# EAGLE design YOTSUBA_GNSS-receiver_Orion_ver.1.3 (EAGLE 9.6.2)
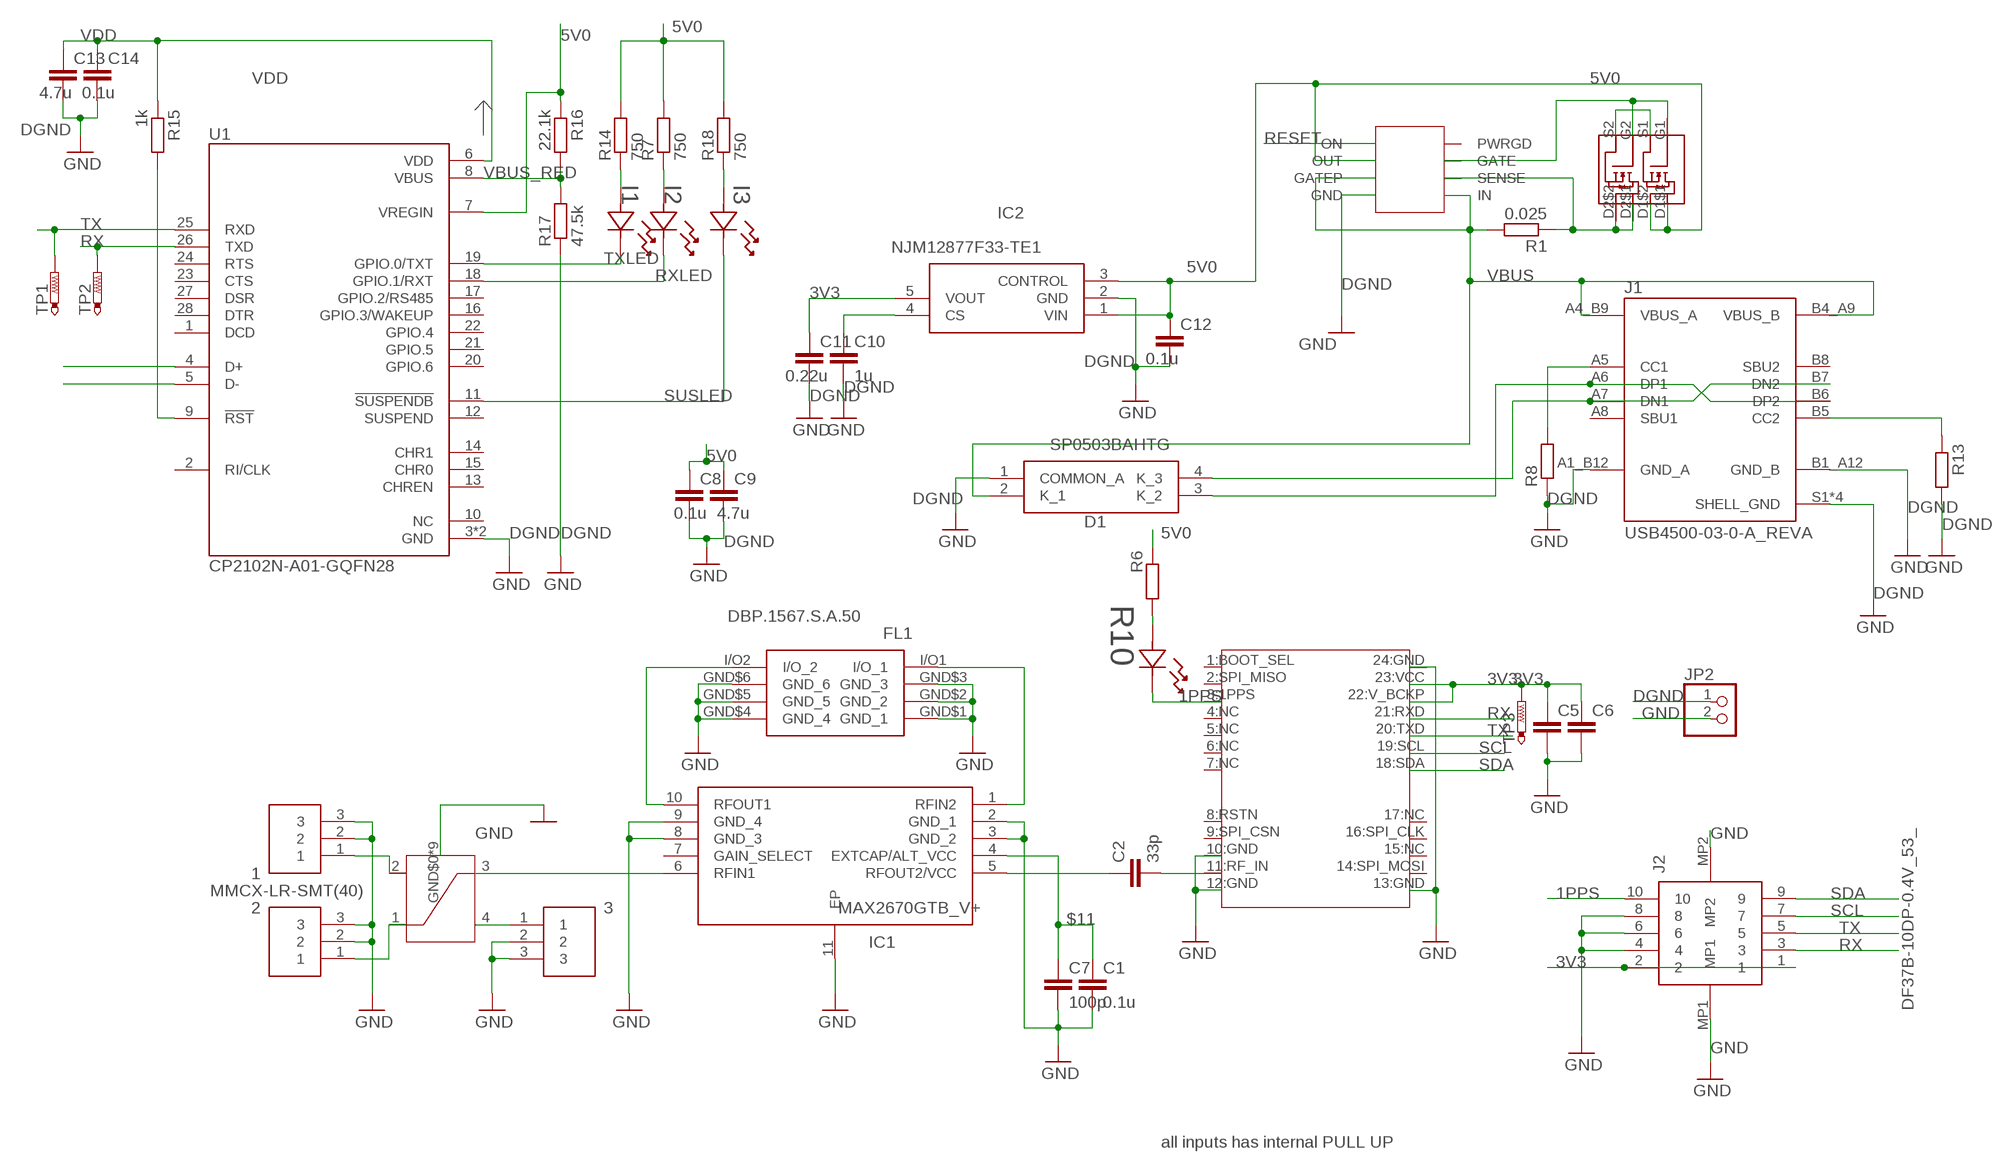
[diagram p0: schematic, sheet 1]

## Parts
1  MMCX-LR-SMT(40)  [MMCX-LR-SMT(40)]
2  MMCX-LR-SMT(40)  [MMCX-LR-SMT(40)]
3  MMCX-LR-SMT(40)  [MMCX-LR-SMT(40)]
C1  0.1u  C-EUC1608  [C1608]
C2  33p  C-EUC1608  [C1608]
C5  C-EUC1608  [C1608]
C6  C-EUC1608  [C1608]
C7  100p  C-EUC1608  [C1608]
C8  0.1u  C-EUC1608  [C1608]
C9  4.7u  C-EUC1608  [C1608]
C10  1u  C-EUC1608  [C1608]
C11  0.22u  C-EUC1608  [C1608]
C12  0.1u  C-EUC1608  [C1608]
C13  4.7u  C-EUC1608  [C1608]
C14  0.1u  C-EUC1608  [C1608]
D1  SP0503BAHTG  [SP0503BAHTG]
FL1  DBP.1567.S.A.50  [DBP1567SA50]
I1  SML-E12P8WT86  [LED_SMLD12_ROM]
I2  SML-E12P8WT86  [LED_SMLD12_ROM]
I3  SML-E12P8WT86  [LED_SMLD12_ROM]
IC1  MAX2670GTB_V+  [SON50P300X300X80-11N]
IC2  NJM12877F33-TE1  [SOT95P280X120-5N]
J1  USB4500-03-0-A_REVA  [GCT_USB4500-03-0-A_REVA]
J2  DF37B-10DP-0.4V_53_  [DF37B10DP04V53]
JP2  PINHD-1X2/90  [1X02/90]
R1  0.025  R-EU_R0603  [R0603]
R6  R-EU_R0603  [R0603]
R7  750  R-EU_R0603  [R0603]
R8  R-EU_R0603  [R0603]
R10  SML-E12P8WT86  [LED_SMLD12_ROM]
R13  R-EU_R0603  [R0603]
R14  750  R-EU_R0603  [R0603]
R15  1k  R-EU_R0603  [R0603]
R16  22.1k  R-EU_R0603  [R0603]
R17  47.5k  R-EU_R0603  [R0603]
R18  750  R-EU_R0603  [R0603]
TP1  PTR1B1,27  [B1,27]
TP2  PTR1B1,27  [B1,27]
TP3  PTR1B1,27  [B1,27]
U1  CP2102N-A01-GQFN28  [QFN50P500X500X80-29N]
U$1  ORION_B16  [ORION_B16]
U$3  HC125.A  [HC125.A]
U$7  DMG6898LSD  [SOIC127P600X150-8N]
U$8  LTC4361  [SOP65P280X100-8N]

## Nets
1PPS: J2.10 R10.1 U$1.3:1PPS
3V3 [POWER]: C5.1 C6.1 C11.1 IC2.5(VOUT) J2.1 J2.2 TP3.TP U$1.22:V_BCKP U$1.23:VCC
5V0 [POWER]: C8.1 C9.1 C12.1 IC2.1(VIN) IC2.3(CONTROL) R6.2 R7.2 R14.2 R16.1 R18.2 U1.7(VREGIN) U$7.D1$1 U$7.D1$2 U$8.OUT
$11 [POWER]: C1.1 C7.1 IC1.4(EXTCAP/ALT_VCC)
D+: D1.3(K_2) J1.A6(DP1) J1.B6(DP2) U1.4(D+)
D-: D1.4(K_3) J1.A7(DN1) J1.B7(DN2) U1.5(D-)
DGND [gnd]: C8.2 C9.2 C10.2 C11.2 C12.2 C13.2 C14.2 D1.1(COMMON_A) IC2.2(GND) J1.A1_B12(GND_A) J1.B1_A12(GND_B) J1.S1(SHELL_GND) J1.S2(SHELL_GND) J1.S3(SHELL_GND) J1.S4(SHELL_GND) JP2.1 R8.1 R13.2 R17.1 U1.3(GND) U1.29(GND) U$8.GND ; supply symbol labelled GND
GND [gnd]: 1.2 1.3 2.2 2.3 3.2 3.3 C1.2 C5.2 C6.2 C7.2 FL1.GND$1(GND_1) FL1.GND$2(GND_2) FL1.GND$3(GND_3) FL1.GND$4(GND_4) FL1.GND$5(GND_5) FL1.GND$6(GND_6) IC1.2(GND_1) IC1.3(GND_2) IC1.8(GND_3) IC1.9(GND_4) IC1.11(EP) J2.4 J2.6 J2.8 J2.MP1 J2.MP2 JP2.2 U$1.10:GND U$1.12:GND U$1.13:GND U$1.24:GND U$3.GND$0(GND) U$3.GND$1(GND) U$3.GND$2(GND) U$3.GND$3(GND) U$3.GND$4(GND) U$3.GND$5(GND) U$3.GND$6(GND) U$3.GND$7(GND) U$3.GND$8(GND)
N$1 [1.1mm]: 1.1 U$3.2
N$2 [1.1mm]: 2.1 U$3.1
N$3 [50Ω]: IC1.6(RFIN1) U$3.3
N$4: C10.1 IC2.4(CS)
N$5: I2.2 R7.1
N$6 [1.1mm]: 3.1 U$3.4
N$8 [50Ω]: FL1.I/O2(I/O_2) IC1.10(RFOUT1)
N$9 [50Ω]: FL1.I/O1(I/O_1) IC1.1(RFIN2)
N$11 [50Ω]: C2.1 IC1.5(RFOUT2/VCC)
N$12 [50Ω]: C2.2 U$1.11:RF_IN
N$13: I1.2 R14.1
N$15: R6.1 R10.2
N$16: I3.2 R18.1
N$19: U$7.S1 U$7.S2
N$20: R1.1 U$7.D2$1 U$7.D2$2 U$8.SENSE
N$21: J1.B5(CC2) R13.1
N$22: U$7.G1 U$7.G2 U$8.GATE
N$23: J1.A5(CC1) R8.2
N$27: R15.2 U1.9(!RST)
RESET [gnd]: U$8.ON
RX: J2.3 TP2.TP U1.26(TXD) U$1.21:RXD
RXLED: I2.1 U1.18(GPIO.1/RXT)
SCL: J2.7 U$1.19:SCL
SDA: J2.9 U$1.18:SDA
SUSLED: I3.1 U1.11(!SUSPENDB)
TX: J2.5 TP1.TP U1.25(RXD) U$1.20:TXD
TXLED: I1.1 U1.19(GPIO.0/TXT)
VBUS: D1.2(K_1) J1.A4_B9(VBUS_A) J1.B4_A9(VBUS_B) R1.2 U$8.GATEP U$8.IN
VBUS_RED: R16.2 R17.2 U1.8(VBUS)
VDD: C13.1 C14.1 R15.1 U1.6(VDD)
Unconnected: IC1.7(GAIN_SELECT) J1.A8(SBU1) J1.B8(SBU2) U1.1(DCD) U1.2(RI/CLK) U1.10(NC) U1.12(SUSPEND) U1.13(CHREN) U1.14(CHR1) U1.15(CHR0) U1.16(GPIO.3/WAKEUP) U1.17(GPIO.2/RS485) U1.20(GPIO.6) U1.21(GPIO.5) U1.22(GPIO.4) U1.23(CTS) U1.24(RTS) U1.27(DSR) U1.28(DTR) U$1.1:BOOT_SEL U$1.2:SPI_MISO U$1.4:NC U$1.5:NC U$1.6:NC U$1.7:NC U$1.8:RSTN U$1.9:SPI_CSN U$1.14:SPI_MOSI U$1.15:NC U$1.16:SPI_CLK U$1.17:NC U$8.PWRGD

## Notes on the sheet
- all inputs has internal PULL UP

## Library data of the parts
1-3 = MMCX-LR-SMT(40):MMCX-LR-SMT(40)
C1 C2 C5-C14 = rcl:C-EU: CAPACITOR, European symbol; SPICEPREFIX: C
D1 = SamacSys_Parts:SP0503BAHTG: ESD Suppressors / TVS Diodes TVS AVAL DIODE SMT Source: Datasheet <https://nl.mouser.com/datasheet/2/240/Littelfuse_TVS_Diode_Array_SP05_Datasheet.pdf-777043.pdf>; ARROW_PART_NUMBER: SP0503BAHTG; ARROW_PRICE-STOCK: https://www.arrow.com/en/products/sp0503bahtg/littelfuse?region=europe; DESCRIPTION: ESD Suppressors / TVS Diodes TVS AVAL DIODE SMT; HEIGHT: 1.22mm; MANUFACTURER_NAME: LITTELFUSE; MANUFACTURER_PART_NUMBER: SP0503BAHTG; MOUSER_PART_NUMBER: 576-SP0503BAHTG; MOUSER_PRICE-STOCK: https://www.mouser.co.uk/ProductDetail/Littelfuse/SP0503BAHTG?qs=uD%2FdkN7XIa0NTYXwHdELYA%3D%3D
FL1 = DBP.1567.S.A.50:DBP.1567.S.A.50: Ceramic Filters Band Pass 1567.5MHz 1dB 50Ohm SMD 2Pin Source: Datasheet <https://www.taoglas.com/datasheets/DBP.1567.S.A.50.pdf>; DESCRIPTION: Ceramic Filters Band Pass 1567.5MHz 1dB 50Ohm SMD 2Pin; HEIGHT: 4.2mm; MANUFACTURER_NAME: Taoglas; MANUFACTURER_PART_NUMBER: DBP.1567.S.A.50
I1-I3 R10 = LED_1608_2:SML-E12P8WT86; COPYRIGHT: Copyright (C) 2023 Ultra Librarian. All rights reserved.; DIGI-KEY_PART_NUMBER_1: 511-1585-1-ND; DIGI-KEY_PART_NUMBER_2: 511-1585-2-ND; DIGI-KEY_PART_NUMBER_3: 511-1585-6-ND; MANUFACTURER_PART_NUMBER: SML-E12P8WT86; MFR_NAME: ROHM Semiconductor
IC1 = MAX2670GTB_V+:MAX2670GTB_V+: RF Amplifier GPS/GNSS Front End Amplifier Source: Datasheet <https://componentsearchengine.com/Datasheets/1/MAX2670GTB_V .pdf>; DESCRIPTION: RF Amplifier GPS/GNSS Front End Amplifier; HEIGHT: 0.8mm; MANUFACTURER_NAME: Analog Devices; MANUFACTURER_PART_NUMBER: MAX2670GTB/V+; MOUSER_PART_NUMBER: 700-MAX2670GTB/V+; MOUSER_PRICE-STOCK: https://www.mouser.com/Search/Refine.aspx?Keyword=700-MAX2670GTB%2FV%2B
IC2 = SamacSys_Parts:NJM12877F33-TE1: LDO Voltage Regulators LDO ADJ High Ripple 3.3V Vo 1% 200mA Source: Datasheet <https://datasheet.datasheetarchive.com/originals/distributors/Datasheets_SAMA/e828f6bebe4b9138c37698b69374413c.pdf>; DESCRIPTION: LDO Voltage Regulators LDO ADJ High Ripple 3.3V Vo 1% 200mA; HEIGHT: 1.2mm; MANUFACTURER_NAME: New Japan Radio; MANUFACTURER_PART_NUMBER: NJM12877F33-TE1; MOUSER_PART_NUMBER: 513-NJM12877F33-TE1; MOUSER_PRICE-STOCK: https://www.mouser.com/Search/Refine.aspx?Keyword=513-NJM12877F33-TE1
J1 = USB4500-03-0-A_REVA:USB4500-03-0-A_REVA; DESCRIPTION: USB-C (USB TYPE-C) USB 2.0 Receptacle Connector 24 (16+8 Dummy) Position Board Edge, Cutout; Surface Mount; Through Hole, Right Angle; DIGI-KEY_PART_NUMBER: 2073-USB4500-03-0-ATR-ND; MF: Global Connector Technology; MP: USB4500-03-0-A; PACKAGE: None; PURCHASE-URL: https://pricing.snapeda.com/search/part/USB4500-03-0-A/?ref=eda
J2 = DF37B-10DP-0.4V_53_:DF37B-10DP-0.4V_53_: Board to Board & Mezzanine Connectors 0.4MM 10P HEADER VERT SMT M-FITTING Source: Datasheet <https://www.arrow.com/en/products/df37b-10dp-0.4v-53/hirose-electric>; DESCRIPTION: Board to Board & Mezzanine Connectors 0.4MM 10P HEADER VERT SMT M-FITTING; HEIGHT: 0.76mm; MANUFACTURER_NAME: Hirose; MANUFACTURER_PART_NUMBER: DF37B-10DP-0.4V(53); MOUSER_PART_NUMBER: 798-DF37B10DP04V53; MOUSER_PRICE-STOCK: https://www.mouser.co.uk/ProductDetail/Hirose-Connector/DF37B-10DP-0.4V53?qs=eDUdFcBPps0qYYvduP3T2g%3D%3D
JP2 = pinhead:PINHD-1X2: PIN HEADER
R1 R6-R8 R13-R18 = rcl:R-EU_: RESISTOR, European symbol; SPICEPREFIX: R
TP1-TP3 = testpad:PTR1: TEST PIN
U1 = CP2102N-A01-GQFN28:CP2102N-A01-GQFN28: USB Bridge, USB to UART USB 2.0 UART Interface 28-QFN (5x5) Check availability <https://pricing.snapeda.com/parts/CP2102N-A01-GQFN28/Silicon%20Labs/view-part?ref=eda>; AVAILABILITY: In Stock; DESCRIPTION: USB Bridge, USB to UART USB 2.0 UART Interface 28-QFN (5x5); MF: Silicon Labs; MP: CP2102N-A01-GQFN28; PACKAGE: QFN-28 Silicon Labs; PRICE: None; PURCHASE-URL: https://pricing.snapeda.com/search/part/CP2102N-A01-GQFN28/?ref=eda
U$1 = Orion_B16:ORION_B16
U$3 = HC125.A:HC125.A
U$7 = DMG6898LSD:DMG6898LSD
U$8 = ltc4361:LTC4361

## Net classes
0 default: clearance 0.121 mm
2 gnd: clearance 0.21 mm to class 1, clearance 0.254 mm
3 POWER: width 0.178 mm, clearance 0.025 mm
4 1.1mm: clearance 0.247 mm to class 1

## Board
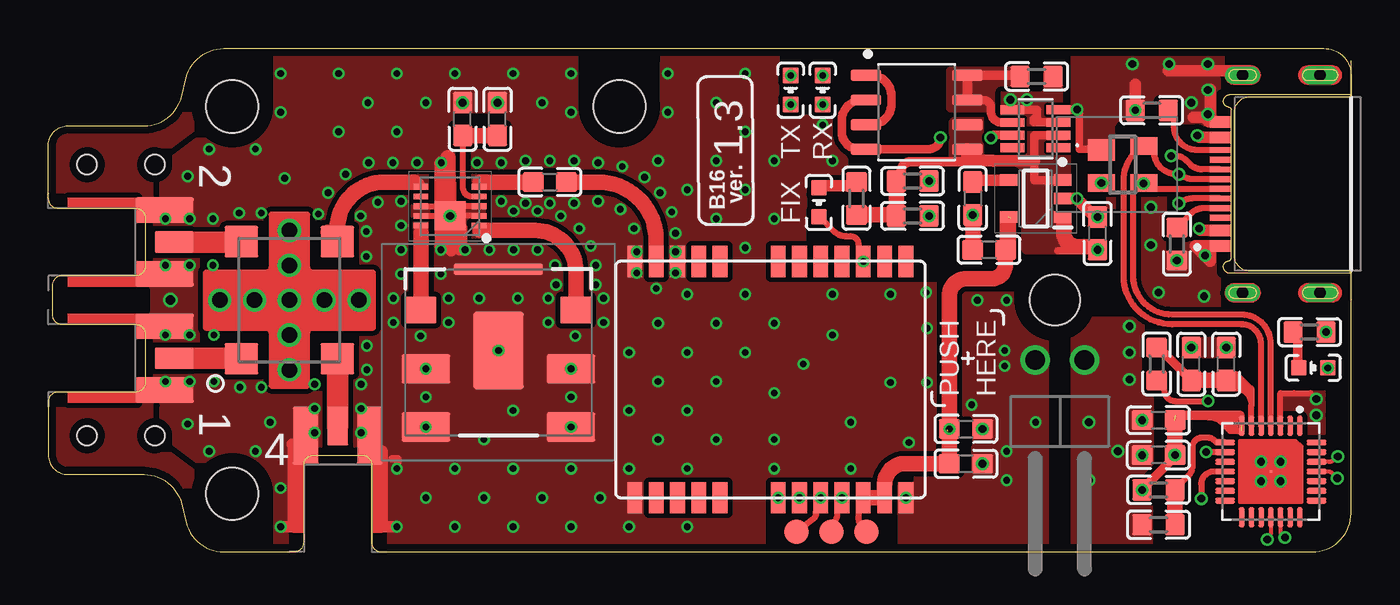
[diagram p1: board, top side]
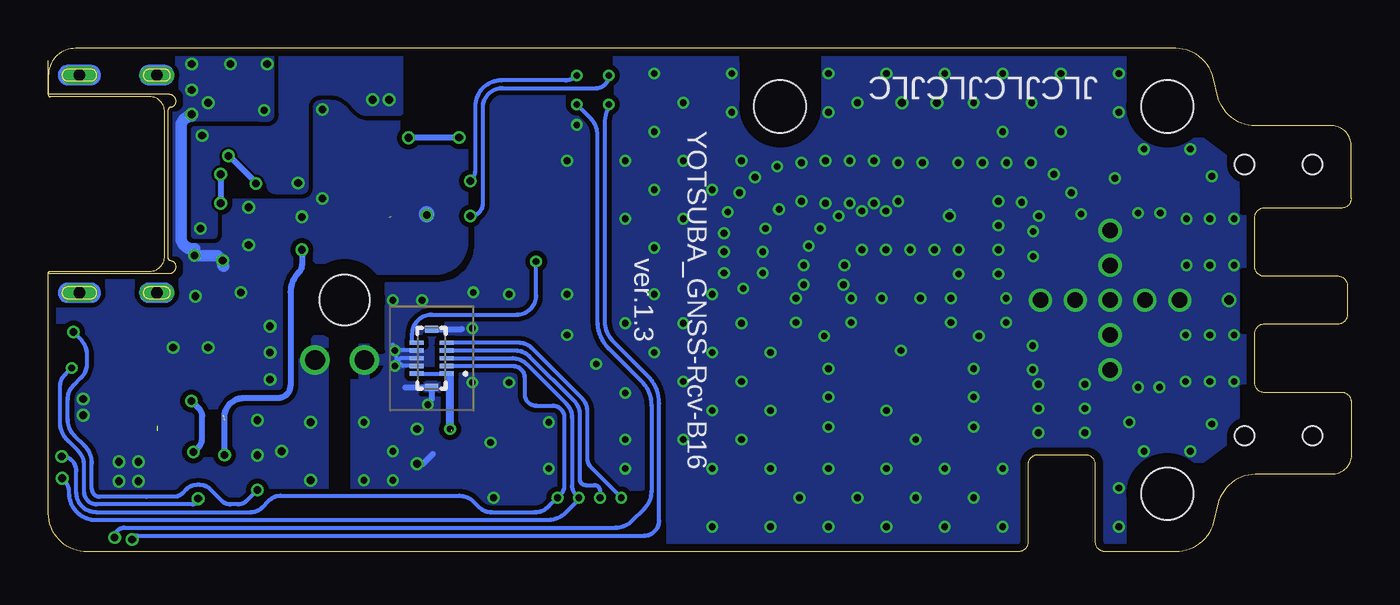
[diagram p2: board, bottom side, seen from below]

Size 67.3 x 26 mm. Coordinates in mm from the lower left corner, seen from the top.
Outline: 1,4 4.94,4 arc-76 6.88,2.48 7.12,1.51 arc76 9.06,0 12.7,0 arc90 13.2,0.5 13.2,4.5 arc-90 13.7,5 16.2,5 arc-90 16.7,4.5 16.7,0.5 arc90 17.2,0 65.3,0 arc90 67.3,2 67.3,14.4 arc90 67.2,14.5 62.05,14.5 arc-90 61.3,15.25 61.3,22.75 arc-90 62.05,23.5 67.2,23.5 arc90 67.3,23.6 67.3,24.6 arc90 65.9,26 9.06,26 arc76 7.12,24.48 6.88,23.52 arc-76 4.94,22 1,22 arc90 0,21 0,18.25 arc90 0.5,17.75 4.5,17.75 arc-90 5,17.25 5,14.75 arc-90 4.5,14.25 0.7,14.25 arc90 0.2,13.75 0.2,12.25 arc90 0.7,11.75 4.5,11.75 arc-90 5,11.25 5,8.75 arc-90 4.5,8.25 0.5,8.25 arc90 0,7.75 0,5 arc90 1,4
Copper layers (1*16): Top 0.035mm / dielectric 1.2mm / Bottom 0.035mm
Design rules "default *": minimum track width 6mil, minimum drill 0.35mm, track to track 5mil, track to pad 0.2mm, pad to pad 5mil, via to via 0.5mm, smd to smd 5mil, copper to edge 0.4mm, drill to drill 6mil, minimum pad ring 0.13mm, minimum via ring 0.13mm, stop-mask expansion 0.038mm, vias tented up to drill 30mil, thermal gap 10mil
Holes 1 mm at 2,6 5.5,6 2,20 5.5,20
Holes 2.7 mm at 9.5,3 9.5,23 29.5,23
Holes 2.6 mm at 52,13
tRestrict: area 50,11 to 54,15; area 27.5,21 to 31.5,25; area 7.5,21 to 11.5,25; area 7.5,1 to 11.5,5; 73 lines
bRestrict: area 50,11 to 54,15; area 27.5,21 to 31.5,25; area 7.5,21 to 11.5,25; area 7.5,1 to 11.5,5; 55 lines

### Footprints (pad centres in the part's own frame; a part is rotated, then mirrored left to right if it is on the bottom)
MMCX-LR-SMT(40) = smd 1.1 x 2: 1 0,-2 | smd 1.3 x 3: 2 1.65,-1.5; 3 -1.65,-1.5
C1608 = smd 1.1 x 1: 1 -0.85,0; 2 0.85,0
SP0503BAHTG = smd 1.1 x 1.4: 1 -0.75,-1.1 | smd 0.9 x 1.4: 2 0.95,-1.1; 3 0.95,1.1; 4 -0.95,1.1
DBP1567SA50 = smd 2.5 x 1.5: GND$1 1.05,6.75; GND$2 1.05,3.75; GND$4 8.55,3.75; GND$5 8.55,6.75 | smd 2.6 x 4: GND$3 4.8,2.8 | smd 4.6 x 0.6: GND$6 4.8,-1.4 | smd 1.6 x 1.4: I/O1 0.8,0.7; I/O2 8.8,0.7
LED_SMLD12_ROM = smd 0.8 x 0.8: 1 -0.75,0; 2 0.75,0
SON50P300X300X80-11N = smd 0.75 x 0.3: 1 -1.5,1; 2 -1.5,0.5; 3 -1.5,0; 4 -1.5,-0.5; 5 -1.5,-1; 6 1.5,-1; 7 1.5,-0.5; 8 1.5,0; 9 1.5,0.5; 10 1.5,1 | smd 1.6 x 1.5: 11 0,0.5
SOT95P280X120-5N = smd 0.9 x 0.6: 1 -1.4,0.95; 2 -1.4,0; 3 -1.4,-0.95; 4 1.4,-0.95; 5 1.4,0.95
GCT_USB4500-03-0-A_REVA = smd 0.6 x 1.1: A1_B12 -3.2,5.15; A4_B9 -2.4,5.15; B1_A12 3.2,5.15; B4_A9 2.4,5.15 | smd 0.3 x 1.1: A5 -1.25,5.15; A6 -0.25,5.15; A7 0.25,5.15; A8 1.25,5.15; B5 1.75,5.15; B6 0.75,5.15; B7 -0.75,5.15; B8 -1.75,5.15 | drill 0.6 pad 0.95 long: S1 -5.62,0; S4 5.62,0 | drill 0.6 pad 0.8 long: S2 5.62,4; S3 -5.62,4
DF37B10DP04V53 = smd 0.23 x 0.73: 1 -0.8,-0.775; 2 -0.8,0.775; 3 -0.4,-0.775; 4 -0.4,0.775; 5 0,-0.775; 6 0,0.775; 7 0.4,-0.775; 8 0.4,0.775; 9 0.8,-0.775; 10 0.8,0.775 | smd 0.38 x 0.68: MP1 -1.5,0; MP2 1.5,0
1X02/90 = drill 1.016: 1 -1.27,-3.81; 2 1.27,-3.81
R0603 = smd 1 x 1.1: 1 -0.85,0; 2 0.85,0
B1,27 = smd 1.27 x 1.27: TP 0,0
QFN50P500X500X80-29N = smd 1.01 x 0.3: 1 -2.36,1.5; 2 -2.36,1; 3 -2.36,0.5; 4 -2.36,0; 5 -2.36,-0.5; 6 -2.36,-1; 7 -2.36,-1.5; 15 2.36,-1.5; 16 2.36,-1; 17 2.36,-0.5; 18 2.36,0; 19 2.36,0.5; 20 2.36,1; 21 2.36,1.5 | smd 0.3 x 1.01: 8 -1.5,-2.36; 9 -1,-2.36; 10 -0.5,-2.36; 11 0,-2.36; 12 0.5,-2.36; 13 1,-2.36; 14 1.5,-2.36; 22 1.5,2.36; 23 1,2.36; 24 0.5,2.36; 25 0,2.36; 26 -0.5,2.36; 27 -1,2.36; 28 -1.5,2.36 | smd 0.127 x 0.127: 29 0,0
ORION_B16 = smd 1.6 x 0.8: 1:BOOT_SEL 12.2,1; 2:SPI_MISO 12.2,2.1; 3:1PPS 12.2,3.2; 4:NC 12.2,4.3; 5:NC 12.2,5.4; 6:NC 12.2,6.5; 7:NC 12.2,7.6; 8:RSTN 12.2,10.6; 9:SPI_CSN 12.2,11.7; 10:GND 12.2,12.8; 11:RF_IN 12.2,13.9; 12:GND 12.2,15; 13:GND 0,15; 14:SPI_MOSI 0,13.9; 15:NC 0,12.8; 16:SPI_CLK 0,11.7; 17:NC 0,10.6; 18:SDA 0,7.6; 19:SCL 0,6.5; 20:TXD 0,5.4; 21:RXD 0,4.3; 22:V_BCKP 0,3.2; 23:VCC 0,2.1; 24:GND 0,1
HC125.A = smd 1.625 x 1.75: 1 -3.022,2.475; 2 3.022,2.475; 3 3.022,-2.475; 4 -3.022,-2.475 | drill 0.8: GND$0 0,0; GND$1 0,3.6; GND$2 0,1.8; GND$3 0,-3.6; GND$4 0,-1.8; GND$5 -3.6,0; GND$6 -1.8,0; GND$7 3.6,0; GND$8 1.8,0
SOIC127P600X150-8N = smd 1.58 x 0.589: D1$1 -2.625,1.905; D1$2 -2.625,0.635; D2$1 -2.625,-0.635; D2$2 -2.625,-1.905; G1 2.625,1.905; G2 2.625,-0.635; S1 2.625,0.635; S2 2.625,-1.905
SOP65P280X100-8N = smd 1.237 x 0.459: GATE 1.187,0.325; GATEP -1.187,-0.325; GND -1.187,-0.975; IN 1.187,-0.975; ON -1.187,0.975; OUT -1.187,0.325; PWRGD 1.187,0.975; SENSE 1.187,-0.325

### Placement (x,y rotation side)
1  4.5,16 90 top
2  4.5,10 90 top
3  14.95,4.5 180 top
C1  23.2,22.35 90 top
C2  25.9,19.1 0 top
C5  47.4,6.35 0 top
C6  47.4,4.55 0 top
C7  21.4,22.35 90 top
C8  57.35,5 180 top
C9  57.35,6.8 180 top
C10  47.75,18.25 270 top
C11  48.6,15.6 180 top
C12  54.2,16.45 90 top
C13  59.05,9.7 90 top
C14  60.85,9.7 90 top
D1  55.5,20 270 top
FL1  28.05,13.2 180 top
I1  40,23.85 90 top
I2  38.35,23.85 90 top
I3  65.35,9.5 180 top
IC1  20.75,17.85 180 top
IC2  51,18.25 180 top
J1  65.7,19 90 top
J2  47.5,10 90 bottom
JP2  52.25,6.1 180 top
R1  51.05,24.55 0 top
R6  41.75,18.25 270 top
R7  44.65,17.35 180 top
R8  58.3,15.9 90 top
R10  39.8,18.05 90 top
R13  57,22.8 180 top
R14  44.65,19.15 180 top
R15  57.25,9.7 270 top
R16  57.35,3.2 0 top
R17  57.35,1.4 0 top
R18  65.15,11.35 0 top
TP1  38.65,1.05 0 top
TP2  40.45,1.05 0 top
TP3  42.25,1.05 0 top
U1  63.15,4.15 270 top
U$1  45.3,2.8 90 top
U$3  12.45,13 90 top
U$7  44.85,22.7 180 top
U$8  51,21.85 180 top

### Tracks (layer width: path | path; a pad name or v marks a point on that pad's centre or on a via)
1PPS  (via drill 0.35)
  Top 0.3: R10.1 39.85,17.3 40.59,16.56 arc45 41.21,16.3 41.45,16.3 arc-90 41.85,15.9 41.85,15.25 U$1.3:1PPS
  Bottom 0.2: J2.10 48.5,10.8 48.5,11.25 arc90 47.5,12.25 43.1,12.25 arc-90 42.1,13.25 U$1.3:1PPS
  other vias: 42.1,15
3V3  (via drill 0.35)  (2 unrouted)
  Top 0.3: TP3.TP 42.13,1.17 arc-45 41.85,1.85 41.85,2.55 U$1.22:V_BCKP
  Top 0.6: IC2.5 49.45,17.3 C11.1 | 49.7,17.25 49.7,15.55
  Top 0.8: C11.1 49.45,14.85 arc-90 48.7,14.1 47.4,14.1 arc90 46.55,13.25 C5.1 C6.1 46.54,4.56 44.27,4.56 arc90 43.2,3.49 U$1.23:VCC U$1.22:V_BCKP
  Bottom 0.2: J2.2 J2.1 46.67,9.2 46.67,6.47 C5.1 | 46.55,6.45 C5.1 | C5.1 46.5,6.3 46.45,6.3 | 46.48,9.2 46.48,6.22
  other vias: 46.55,6.35
5V0  (via drill 0.4)  (2 unrouted)
  Top 0.305: 61.35,6.25 61.05,6.25 60.95,6.35 | 61.35,6.25 61.65,6.25 | 60.85,6.45 60.57,6.73 arc45 60.04,6.95 59.9,6.95 59.8,7.05 | 60.85,6.45 60.95,6.35 | 61.65,6.95 61.55,7.05 | 61.35,6.25 61.35,7 61.3,7.05 | 61.05,7.05 61.05,6.45 60.95,6.35 | 60.85,7.1 60.85,6.45 | U$7.D1$1 47.58,20.8 47.58,20.7 | U$7.D1$1 47.91,20.8 | U$7.D1$1 47.52,20.8 47.53,20.8 48.01,20.8
  Top 0.4: IC2.1 52.45,17.3 52.45,17.09 | 53.2,15.75 53.2,15.55 52.15,15.55
  Top 0.45: U$8.OUT 50.95,21.52 50.95,20.2 50.95,19.2 IC2.3
  Top 0.5: 61.55,7.05 61.3,7.05 61.05,7.05 59.8,7.05 58.25,7.05 | C8.1 58.2,4.9 R16.1 | R14.2 44.05,19.4 44.05,19.64 arc-90 44.55,20.14 47.42,20.14 47.48,20.2 U$7.D1$1
  Top 0.6: 50.95,20.2 50.94,20.19 48.84,20.19
  Top 0.61: 48.84,20.19 47.48,20.19 U$7.D1$1
  Top 0.8: C8.1 C9.1 | R14.2 R7.2 43.8,17.4 R6.2 | C12.1 54.05,15.75 53.2,15.75 arc-90 52.45,16.5 52.45,17.09
  Bottom 0.2: R16.1 57.07,2.63 arc45 57.5,2.45 57.9,2.45 arc45 58.33,2.63 58.93,3.23 arc-45 59.48,3.46 59.62,3.46 arc-45 60.17,3.23 60.37,3.03 arc45 60.8,2.85 62.23,2.85 62.24,2.84 64.65,2.84 arc90 65.05,3.24 65.05,4.56 arc-45 65.43,5.48 65.96,6.01 arc45 66.3,6.83 66.3,7.87 arc45 65.99,8.61 65.59,9.01 arc-45 65.3,9.71 65.3,10.18 arc-45 65.63,10.97 R18.2
  Bottom 0.3: C8.1 58.2,6.95 arc90 57.2,7.95 55.42,7.95 arc-90 54.79,8.59 54.79,13.43 arc45 54.39,14.4 arc-45 54.2,14.85 C12.1
  other vias: 58.2,5 54.2,15.6 56.5,3.2 66,11.35
  pour Top (no thermals): 52.55,21.45 50.55,21.45 50.55,20.3 48.85,20.3 48.85,22.15 46.8,22.15 46.8,20.2 49.87,20.2 arc-90 50.55,19.52 50.55,15.65 52.55,15.65
$11
  Top 0.305: IC1.4 21.87,18.35 arc-90 21.42,18.8 21.42,21.5 | 21.35,21.5 C7.1
  Top 0.6: 21.42,21.5 21.35,21.5
  Top 0.8: C1.1 21.42,21.5
D+  (via drill 0.4)
  Top 0.3: U1.4 63.15,10.75 arc90 61.65,12.25 58.05,12.25 arc-90 56.05,14.25 56.05,19.02 v56.58,19.02 | v56.58,19.02 56.45,19.02 | D1.3 v56.58,19.02 | v56.58,19.02 arc45 56.7,18.9 57.07,18.75 J1.A6 | J1.B6 59.59,19.75 arc-45 59.01,19.99 58.81,20.19 arc45 58.18,20.45 v58,20.45
  Bottom 0.3: v56.58,19.02 56.58,19.07 57.95,20.45 v58,20.45
D-  (via drill 0.4)
  Top 0.3: J1.A7 59.16,19.25 arc-45 58.29,19.61 v58.4,19.5 58.33,19.5 arc-45 57.43,19.87 arc-45 57.12,20.64 56.93,20.82 D1.4 56.45,20.95 56.17,20.67 arc45 55.55,19.17 55.55,14.25 arc90 58.05,11.75 61.65,11.75 arc-90 62.65,10.75 U1.5 | J1.B7 59.08,18.25 arc45 58.47,18 v58.4,18
  Bottom 0.3: v58.4,19.5 v58.4,18
DGND  (via drill 0.35, 0.4)
  Top 0.2: U$8.GND 52.65,22.82
  Top 0.3: 63.55,4.75 v63.65,4.65 | 63.65,8.2 64.35,8.2 | C14.2 | C14.2 | v59.05,10.56 C13.2 | 54.62,20.87 54.5,20.75 D1.1
  Top 0.305: U1.3 63.65,8.2 | 64.35,8.2 65.2,8.2 v65.5,7.9
  Top 0.4: C14.2 60.85,10.85 | D1.1 54.35,20.8 53.28,20.8 arc-90 53.26,20.82 53.26,22.86 53.12,22.86
  Top 0.45: 52.65,22.82 52.98,22.82 | U$8.GND 53.12,22.82 arc90 v53.15,22.85
  Top 0.5: C12.2 54.05,17.3 | v53.15,18.25 53.15,18.2 | J1.S3 61.9,13.38
  Top 0.6: C8.2 v56.5,4.99 | J1.B1_A12 60.05,22.2 | 60.05,22.2 59.95,22.2 59.79,22.36 60.04,22.36 60.04,23.9 | IC2.2 v53.15,18.25 | J1.A1_B12 59.25,15.8 v59.75,15.3 60.04,15.01 60.04,15.6 | D1.1 54.6,20.95 | 60.05,22.2 60.05,22.45 v59.9,22.6 59.9,22.46 59.15,22.46 | 54.05,17.3 53.15,18.2 | 56.15,24.15 R13.2 | 65.68,13.4 J1.S1 65.35,13.38 | J1.S2 61.7,24.86 58.94,24.86 58.94,24.85 57.85,24.85
  Top 0.8: C11.2 C10.2
  Bottom 0.2: R13.2 56.15,22.75 56.1,22.75 | C12.2 54.2,17.25
  Bottom 0.3: 58.25,14.75 58.3,14.7 | C14.2 | C14.2 | v59.05,10.56 58.99,10.56 | 54.2,17.25 54.15,17.3
  Bottom 0.6: 58.25,14.75 58.3,14.8 R8.1 58.55,15.3 v59.75,15.3 59.75,15.65 59.85,15.65 arc90 60.45,16.25 60.45,21.95 arc90 59.9,22.5 arc90 v59.9,22.6
  Bottom 0.8: C10.2 47.75,17.45
  other vias: 56.5,6.8 58.3,15.05 56.15,22.8 60.85,10.55 47.75,17.4 63.65,3.65 62.65,3.65 62.65,4.65 59.7,13.2 56.95,17.8 59.9,23.85 54.2,17.3 59.05,23.2 55.85,11.65 55.85,10.3 55.85,8.9 57.35,13.4 53.75,3.7 56.95,15.85 65.5,7.05 55.25,5.2 53.75,6.7 59.9,25.2 56,25.2 57.9,25.2
  pour Top (no thermals): 53.1,26.95 53.1,-1.65 69.85,-1.65 69.85,26.95
  pour Bottom (no thermals): 45.9,28.55 45.9,16 arc90 47.3,14.6 52.05,14.6 arc-90 53.1,13.55 53.1,-0.25 arc90 54.6,-1.75 68,-1.75 arc90 69,-0.75 69,28.85 arc90 68,29.85 47.2,29.85 arc90
GND  (via drill 0.35, 0.4, 0.5)
  Top 0.152: IC1.11 20.7,17.35 20.28,17.77 20.2,17.77
  Top 0.2: v21.52,15.6 21.25,15.88 21.25,15.89
  Top 0.3: 20.63,17.39 20.7,17.32 | IC1.9 IC1.11 | IC1.8 20.75,17.85 20.75,17.81
  Top 0.305: IC1.2 20.78,17.35 20.78,17.34 | IC1.3 20.75,17.85
  Top 0.4: 18.05,4.35 18.05,4.8 17.75,4.8
  Top 0.6: IC1.11 20.25,16.85 20.25,15.6 | v20.27,15.6 20.25,15.62 20.25,15.69 | IC1.11 21.35,16.75 21.35,15.99 21.25,15.89 21.25,15.59 | 20.8,16.8 20.8,15.54 | IC1.11 20.75,17.45 20.65,17.55 | v12,1.3 12.65,1.3 12.65,5.55 12.6,5.55 | v18,1.3 17.25,1.3 | 17.2,1.35 17.25,1.3 | 17.25,1.3 17.25,5.2 17.15,5.2
  Top 0.8: 20.78,17.34 20.75,17.81 | IC1.11 20.35,17.75 20.35,20.05 | 20.65,20.35 20.65,17.85
  Bottom 0.2: J2.8 49.2,10.4 49.3,10.5 | 49.3,10.5 49.5,10.7 | J2.6 49.1,10 49.25,9.85 | 49.25,9.85 49.3,9.8 49.3,10.5 | J2.4 49,9.6 49.25,9.85 | J2.MP2 47.5,11.45 47.65,11.45 47.65,11.5
  Bottom 0.3: 47.95,4.55 47.45,5.05 | 47.65,11.5 45.95,11.5 | 48.85,8.5 J2.MP1 47.5,7.9
  Bottom 0.305: C7.2 21.45,23.2 21.45,23.15 | C1.2 23.15,23.2 | IC1.11 20.72,17.35 20.72,17.59
  Bottom 0.45: C5.2 48.25,6.4 | C6.2 48.35,4.55
  other vias: 12,24.7 12,3.3 12,22.7 10.7,20.8 8.3,20.8 10.7,5.2 8.3,5.2 6.05,14.8 6.05,11.2 6.05,17.2 6.05,8.8 6.3,13 7.2,19.4 7.2,6.6 11.45,6.7 12.2,19.3 21.4,23.2 23.2,23.2 20.75,17.35 20.3,20.1 13.95,17.45 21,1.3 24,1.3 27,1.3 22.5,2.8 25.5,2.8 24,4.3 15,24.7 18,24.7 21,24.7 24,24.7 27,24.7 16.5,23.2 19.5,23.2 25.5,23.2 27,22.7 18,21.7 15,21.7 32,24.7 16.45,9.4 23.25,10.4 19.5,9.45 19.5,6.45 27,6.45 27,9.45 32,22.7 22.25,13.1 24.25,13.1 22.15,20.1 23.4,20.1 24.65,20.2 19.05,20.1 17.8,20.1 16.55,20.1 23.4,18.1 24.65,18 25.9,18 25.9,20.2 27.15,20.2 28.4,20.1 27.15,18 28.4,18.1 24.02,17.6 25.27,17.6 24.02,15.6 22.77,15.6 20.27,14.35 18.23,15.6 18.23,14.35 18.23,16.85 18.23,18.1 25.27,15.6 26.23,13.8 28.27,13.8 28.02,15.8 27.43,16.7 26.48,17.35 28.27,14.8 26.18,14.8 17.02,18.05 16.12,17.35 14.45,18.55 15.35,19.5 17.82,13.1 20.68,13.1 17.82,11.85 20.68,11.85 25.82,13.1 28.68,13.1 25.82,11.85 28.68,11.85 16.43,16.55 16.43,15.25 16.45,10.65 16.15,8.65 16.15,7.4 16.15,6.15 13.75,7.4 13.75,6.15 13.75,8.65 19.23,11.15 27.23,11.15 7.3,17.2 8.5,17.2 7.3,14.8 8.5,14.8 7.3,11.2 8.55,11.2 7.3,8.8 8.55,8.8 9.85,17.5 9.9,8.5 11,17.5 11,8.5 44.3,2.8 48.25,6.35 48.25,4.55 37.5,8.2 41.45,6.7 43.5,8.75 45.4,8.75 47.7,7.6 51,6.7 51,3.7 49.5,5.2 30,1.3 33,1.3 36,15.7 34.5,17.2 37.5,17.2 36,18.7 37.5,20.2 34.5,20.2 36,21.7 34.5,23.2 36,24.7 33,18.7 31.5,20.2 29.65,19.9 29.55,17.7 30.8,19.35 31.6,18.55 32.2,17.55 32.4,16.45 30.25,16.7 30.4,15.5 32.4,15.5 30.4,14.4 32.4,14.4 31.4,13.6 39,9.7 40.5,11.2 41.45,4.3 19.5,2.8 18,4.3 21,4.3 27,4.3 28.5,2.8 30,4.3 33,4.3 31.5,5.8 30,7.3 30,10.3 31.5,8.8 33,7.3 34.5,5.8 34.5,8.8 34.5,11.8 36,10.3 37.5,11.8 36,13.3 33,13.3 33,10.3 31.5,11.8 22.5,5.8 24,7.3 27,8 19.5,8 37.5,5.8 40.5,13.3 37.5,4.3 44.45,5.65 49.5,13 43.5,13.3 45.35,13.4 49.4,10.4 49.4,9.6 40.5,20.2 40,22.05 49.5,3.7 48,13 45.4,11.55
  pour Top (no thermals): -3.65,26.9 50.45,26.9 50.45,24.45 44.5,24.45 44.5,13.65 51.4,13.65 51.4,-3.25 -3.65,-3.25
  pour Bottom: -5.15,28.7 45,28.7 45,15.85 arc90 47.2,13.65 50.95,13.65 arc-90 51.4,13.15 51.4,-1.9 arc-90 50.95,-2.4 -5.15,-2.4 arc-90 -5.35,-2.2 -5.35,28.5 arc-90
N$1
  Top 1.1: 1.1 9.9,16 9.93,15.97 U$3.2
N$2
  Top 1.1: U$3.1 9.95,10 2.1
N$3
  Top 0.3: 18.9,19.1 19.25,19.1 IC1.6
  Top 0.8: 14.45,16.5 U$3.3 14.92,16.64 arc-90 17.36,19.1 18.9,19.1
  pour Top (no thermals): 19.65,18.7 19.65,19.5 18.75,19.5 18.75,18.7
N$4
  Top 0.6: C10.1 47.75,19.2 IC2.4
N$5  (via drill 0.35, 0.4)
  Bottom 0.2: R7.1 arc-90 44.85,18 44.85,22.95 arc90 43.85,23.95 39,23.95 arc-90 I2.2
  other vias: 45.5,17.35 38.35,24.6
N$6
  Top 1: U$3.4 14.95,10
  Top 1.1: 14.95,10 3.1
N$8
  Top 0.3: 19.25,16.44 IC1.10
  Top 0.8: 19.23,12.5 FL1.I/O2 19.25,16.44
  pour Top (no thermals): 19.65,16.4 19.65,17.05 18.85,17.05 18.85,16.4
N$9
  Top 0.3: 26.95,12.8 FL1.I/O1 | 22.3,16.6 22.25,16.6 IC1.1
  Top 0.8: 22.3,16.6 25.15,16.6 arc-90 27.25,14.5 FL1.I/O1
  pour Top (no thermals): 21.85,17 21.85,16.2 22.75,16.2 22.75,17
N$11
  Top 0.3: 22.3,19.1 22.3,18.9 IC1.5
  Top 0.8: C2.1 22.3,19.1
  pour Top (no thermals): 21.85,19.5 22.7,19.5 22.7,18.7 21.85,18.7
N$12
  Top 0.8: C2.2 28.4,19.1 arc-90 31.4,16.1 U$1.11:RF_IN
N$13  (via drill 0.35, 0.4)
  Bottom 0.2: I1.2 arc45 40.6,24.35 43.9,24.35 arc-90 45.25,23 45.25,19.75 arc45 R14.1
  other vias: 45.5,19.15 40,24.6
N$15
  Top 0.4: R10.2 39.9,18.9 | 41.75,18.9 R6.1
  Top 0.6: 41.75,18.9 39.9,18.9
N$16
  Top 0.4: R18.1 64.55,11.1
  Top 0.5: 64.55,11.1 64.55,9.55 I3.2
N$19
  Top 0.45: U$7.S1 42.5,22.07 arc90 43.55,23.11 43.55,23.55 arc90 42.5,24.61 U$7.S2
N$20
  Top 0.45: U$8.SENSE 49.23,22.18 arc-90 48.7,22.71 48.7,22.93 arc90 48.3,23.34 U$7.D2$1
  Top 0.5: U$7.D2$1 U$7.D2$2 50.2,24.61 R1.1
  pour Top (no thermals): 46.6,24.85 50.45,24.85 50.45,24.25 49.22,24.25 arc90 48.7,23.73 48.7,22.9 46.6,22.9
N$21
  Top 0.3: R13.1 58.05,22.75 58.15,22.65 58.15,21.99 arc45 58.53,21.09 arc45 59.34,20.75 59.35,20.75 J1.B5
N$22  (via drill 0.4)
  Top 0.45: U$7.G2 42.04,23.34 arc90 40.99,22.29 40.99,21.7 arc90 41.89,20.8 U$7.G1 45.48,20.8 arc90 v46.09,21.4 | U$8.GATE 48.82,21.53 48.82,21.38 v48.69,21.38
  Bottom 0.3: 48.67,21.4 v46.09,21.4
  Bottom 0.45: v48.69,21.38 48.67,21.4
N$23
  Top 0.3: J1.A5 59.71,17.75 arc45 59.01,17.46 R8.2
N$27  (via drill 0.4)
  Top 0.3: U1.9 v59.81,5.15 arc45 v59.8,5.15 | v59.91,7.79 58.21,7.79 arc-90 57.65,8.35 57.65,8.65 57.45,8.85 R15.2
  Bottom 0.3: 59.85,5.2 v59.8,5.15 59.54,5.41 arc-45 59.36,5.86 59.36,6.97 arc-45 59.54,7.42 v59.91,7.79
RX  (via drill 0.35, 0.4)
  Top 0.2: 66.58,4.93 66.39,4.74 arc-45 66.17,4.65 U1.26
  Top 0.3: U1.26 | v66.61,4.93 66.58,4.93 | U$1.21:RXD 40.75,2.55 40.75,1.95 arc-45 40.57,1.52 40.45,1.4 TP2.TP
  Bottom 0.2: v66.61,4.93 arc90 65.85,4.17 65.85,3.05 arc-90 64.85,2.05 56.83,2.05 arc-45 56.27,2.28 55.88,2.67 arc45 55.32,2.9 46.06,2.9 arc45 45.36,2.61 45.09,2.34 arc-45 44.39,2.05 42.16,2.05 arc-45 41.46,2.34 U$1.21:RXD 40.84,2.96 arc-45 40.65,3.41 40.65,6.95 arc-90 41.25,7.55 42.1,7.55 arc90 42.7,8.15 42.7,9 arc-90 43.3,9.6 J2.3
  other vias: 41,2.8
RXLED  (via drill 0.35, 0.4)
  Top 0.2: U1.18 63.15,0.98 arc-45 63.06,0.76 62.97,0.67
  Top 0.3: U1.18 | v62.97,0.64 62.97,0.67
  Bottom 0.2: v62.97,0.64 62.83,0.78 arc45 62.69,0.84 36.52,0.84 arc-90 35.75,1.61 35.75,7.67 arc-45 36.34,9.09 38.12,10.87 arc45 38.55,11.91 38.55,22.1 arc22 38.4,22.86 38.35,22.98 arc45 I2.1
  other vias: 38.35,23.1
SCL  (via drill 0.35)
  Bottom 0.2: J2.7 43.16,10.4 arc45 42.46,10.11 40.14,7.79 arc45 39.85,7.09 39.85,3.75 arc-90 39.55,3.45 39.1,3.45 arc90 38.8,3.15 U$1.19:SCL
  other vias: 38.8,2.8
SDA  (via drill 0.35)
  Bottom 0.2: U$1.18:SDA 39.27,4.37 arc45 39.45,4.8 39.45,7.24 arc-45 39.74,7.94 42.31,10.51 arc-45 43.01,10.8 J2.9
  other vias: 37.7,2.8
SUSLED  (via drill 0.35, 0.4)
  Top 0.3: U1.11 60.21,4.15 arc90 59.56,3.5 v59.56,2.75
  Bottom 0.2: v59.56,2.75 arc90 59.86,2.45 64.8,2.45 arc90 65.45,3.1 65.45,4.49 arc-45 65.74,5.19 66.29,5.74 arc45 66.7,6.73 66.7,8.52 arc45 66.43,9.17 I3.1
  Bottom 0.3: v59.56,2.75 v59.55,2.75
  other vias: 66.1,9.5
TX  (via drill 0.35, 0.4)
  Top 0.2: v66.59,3.8 66.33,4.06 arc45 66.11,4.15 U1.25
  Top 0.3: 38.9,1.05 TP1.TP 39.52,1.71 arc53 39.65,1.96 39.65,2.05 39.9,2.3 U$1.20:TXD
  Bottom 0.2: v66.59,3.8 66.5,3.71 arc45 66.24,3.09 66.24,3.02 arc-90 64.84,1.65 41.58,1.65 arc-45 40.58,2.02 39.9,2.7 U$1.20:TXD 40.06,2.96 arc45 40.25,3.41 40.25,6.94 arc-45 40.54,7.64 42.61,9.71 arc-45 43.31,10 J2.5
  other vias: 39.9,2.8
TXLED  (via drill 0.35, 0.4)
  Top 0.2: U1.19 63.65,1.1 arc45 63.74,0.88 v63.88,0.74
  Top 0.3: U1.19
  Bottom 0.2: v63.88,0.74 arc90 63.37,1.25 38.01,1.25 arc-45 37.14,1.61 36.51,2.24 arc-45 36.15,3.11 36.15,7.57 arc-45 36.66,8.82 38.36,10.51 arc45 38.95,11.93 38.95,21.52 arc-45 39.32,22.42 I1.1
  other vias: 40,23.1
VBUS  (via drill 0.4)
  Top 0.2: U$8.IN 49.81,23.35 v49.7,23.35
  Top 0.3: J1.A4_B9 60.54,16.59 60.46,16.59
  Top 0.45: U$8.GATEP 51.06,22.18 51.06,22.82 U$8.IN | 50.91,22.18 50.9,22.38
  Top 0.5: R1.2
  Top 0.6: J1.A4_B9 59.5,16.6 59.45,16.65 v59.45,16.7 | J1.B4_A9 59.45,21.4 v59.35,21.5
  other vias: 54.4,19.05 50.55,23.35
  pour Top (no thermals): 52.25,22.1 49.35,22.1 49.35,24.85 52.25,24.85
  pour Bottom (no thermals): 59.75,21.8 59.75,16.35 55,16.35 55,17.66 arc90 54.16,18.5 arc-90 53.7,18.96 53.7,23.55 arc90 53.6,23.65 52.25,23.65 51.3,22.7 49.15,22.7 49.15,27 55.3,27 55.3,22.84 arc90 56.34,21.8
VBUS_RED
  Top 0.3: 60.35,5.65 U1.8 60.34,5.65 60.24,5.75 arc45 59.88,5.9 59.6,5.9 arc90 59.1,5.4 59.1,4.47 arc-45 58.85,3.87 58.2,3.22 R16.2
  Top 0.8: R16.2 R17.2
VDD
  Top 0.3: U1.6 62.15,7.6 arc90 61.29,8.46 61.4,8.46 | C14.1 60.85,9.15 61.4,9.15 | 61.4,9.15 61.7,8.85 | 61.7,8.85 62.1,8.45 | 62.1,8.45 arc90 62.15,8.4 62.15,7.55 | 61.4,9.15 61.4,8.46 | 61.4,8.46 61.4,8.45 61.7,8.45 | 61.7,8.45 62.1,8.45 | 61.7,8.85 61.7,8.45
  Top 0.305: 61.29,8.46 61.24,8.46 C14.1
  Top 0.5: C13.1 57.72,10.18 57.28,10.55 R15.1
  Top 0.8: C13.1 C14.1

### Text on the board
tPlace: 1.3 | TX | RX | 2 | B16 | ver. | FIX | PUSH | HERE | 1 | 4
bNames: JLCJLCJLCJLC | YOTSUBA_GNSS-Rcv-B16 | ver.1.3